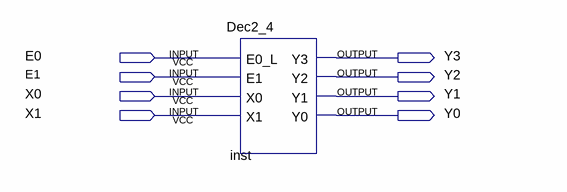
[diagram p0: schematic sheet]
// Quartus schematic DecoderDemo.bdf as structural Verilog: 1 symbols, 8 pins
module DecoderDemo (
  input  E0,
  input  E1,
  input  X0,
  input  X1,
  output Y3,
  output Y2,
  output Y1,
  output Y0
);

  Dec2_4 inst (.E0_L(E0), .E1(E1), .X0(X0), .X1(X1), .Y3(Y3), .Y2(Y2), .Y1(Y1), .Y0(Y0));
endmodule
